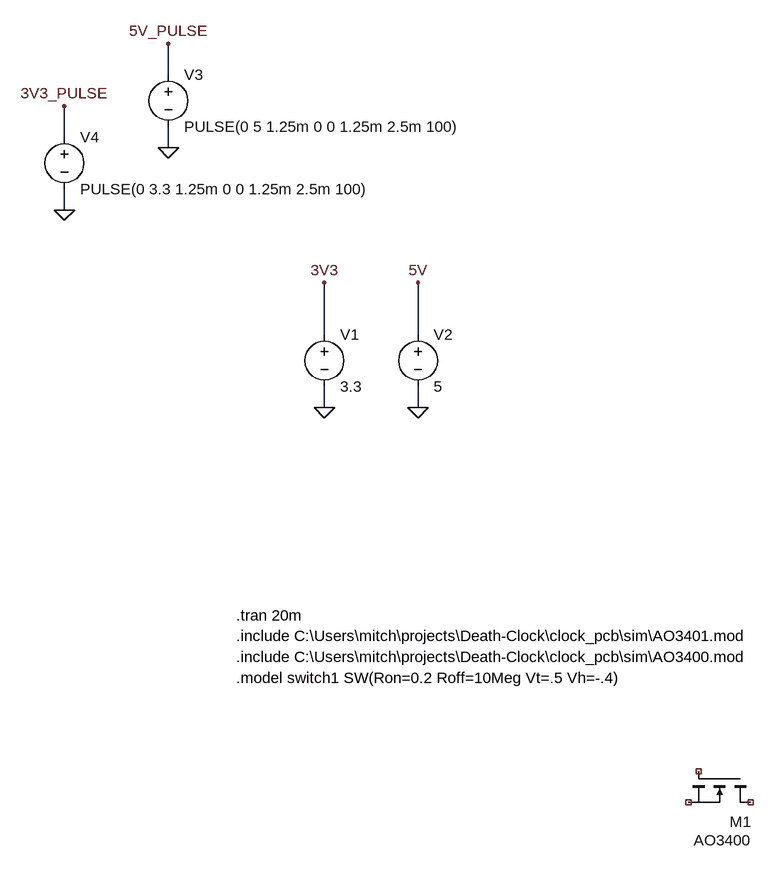
[diagram p0: schematic display.asc]
display.asc, the LTspice schematic file:
Version 4
SHEET 1 1272 940
WIRE -784 -256 -784 -304
WIRE -944 -160 -944 -208
WIRE -784 -144 -784 -176
WIRE -944 -48 -944 -80
WIRE -544 144 -544 64
WIRE -400 144 -400 64
WIRE -544 256 -544 224
WIRE -400 256 -400 224
FLAG -544 64 3V3
FLAG -400 256 0
FLAG -400 64 5V
FLAG -784 -304 5V_PULSE
FLAG -784 -144 0
FLAG -544 256 0
FLAG -944 -208 3V3_PULSE
FLAG -944 -48 0
SYMBOL voltage -544 128 R0
WINDOW 123 0 0 Left 0
WINDOW 39 0 0 Left 0
SYMATTR InstName V1
SYMATTR Value 3.3
SYMBOL voltage -400 128 R0
WINDOW 123 0 0 Left 0
WINDOW 39 0 0 Left 0
SYMATTR InstName V2
SYMATTR Value 5
SYMBOL nmos 112 816 R90
WINDOW 0 78 -1 VRight 2
WINDOW 3 79 56 Invisible 2
WINDOW 38 106 -1 VRight 2
SYMATTR InstName M1
SYMATTR Value ""
SYMATTR SpiceModel AO3400
SYMATTR Prefix X
SYMBOL voltage -944 -176 R0
WINDOW 123 0 0 Left 0
WINDOW 39 0 0 Left 0
SYMATTR InstName V4
SYMATTR Value PULSE(0 3.3 1.25m 0 0 1.25m 2.5m 100)
SYMBOL voltage -784 -272 R0
WINDOW 123 0 0 Left 0
WINDOW 39 0 0 Left 0
SYMATTR InstName V3
SYMATTR Value PULSE(0 5 1.25m 0 0 1.25m 2.5m 100)
TEXT -680 576 Left 2 !.tran 20m
TEXT -680 672 Left 2 !.model switch1 SW(Ron=0.2 Roff=10Meg Vt=.5 Vh=-.4)
TEXT -680 608 Left 2 !.include C:\\Users\\mitch\\projects\\Death-Clock\\clock_pcb\\sim\\AO3401.mod
TEXT -680 640 Left 2 !.include C:\\Users\\mitch\\projects\\Death-Clock\\clock_pcb\\sim\\AO3400.mod

The netlist it stands for:
* display.asc
V1 3V3 0 3.3
V2 5V 0 5
XM1 NC_01 NC_02 NC_03 AO3400  ; pins D G S
V4 3V3_PULSE 0 PULSE(0 3.3 1.25m 0 0 1.25m 2.5m 100)
V3 5V_PULSE 0 PULSE(0 5 1.25m 0 0 1.25m 2.5m 100)
.tran 20m
.model switch1 SW(Ron=0.2 Roff=10Meg Vt=.5 Vh=-.4)
.include C:\Users\mitch\projects\Death-Clock\clock_pcb\sim\AO3401.mod
.include C:\Users\mitch\projects\Death-Clock\clock_pcb\sim\AO3400.mod
.backanno
.end